# EAGLE schematic schematic (EAGLE 8.2.2)
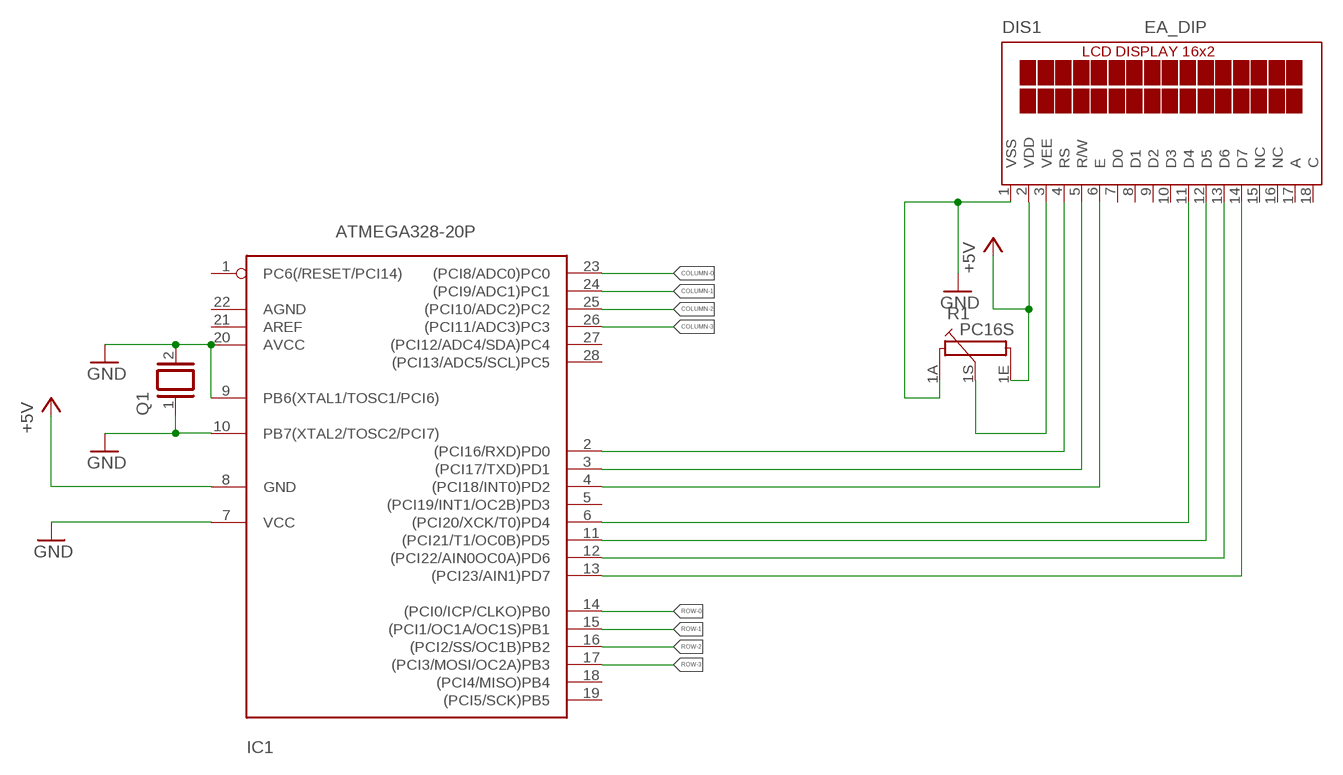
[diagram p0: schematic, sheet 1]

## Parts
DIS1  EA_DIP  [EA_DIP]
IC1  ATMEGA328-20P  [DIL28-3]
Q1  XTAL  [Q]
R1  PC16S  [PC16S]

## Nets
+5V: DIS1.2(VDD) IC1.8(GND) R1.1E
GND: DIS1.1(VSS) IC1.7(VCC) IC1.9(PB6(XTAL1/TOSC1/PCI6)) IC1.10(PB7(XTAL2/TOSC2/PCI7)) IC1.20(AVCC) Q1.1 Q1.2 R1.1A
N$1: DIS1.4(RS) IC1.2((PCI16/RXD)PD0)
N$2: DIS1.5(R/W) IC1.3((PCI17/TXD)PD1)
N$3: DIS1.6(E) IC1.4((PCI18/INT0)PD2)
N$4: DIS1.14(D7) IC1.13((PCI23/AIN1)PD7)
N$5: DIS1.13(D6) IC1.12((PCI22/AIN0OC0A)PD6)
N$6: DIS1.12(D5) IC1.11((PCI21/T1/OC0B)PD5)
N$7: DIS1.11(D4) IC1.6((PCI20/XCK/T0)PD4)
N$9: DIS1.3(VEE) R1.1S
Unconnected: DIS1.7(D0) DIS1.8(D1) DIS1.9(D2) DIS1.10(D3) DIS1.15(NC) DIS1.16(NC) DIS1.17(A) DIS1.18(C) IC1.1(PC6(/RESET/PCI14)) IC1.5((PCI19/INT1/OC2B)PD3) IC1.14((PCI0/ICP/CLKO)PB0) IC1.15((PCI1/OC1A/OC1S)PB1) IC1.16((PCI2/SS/OC1B)PB2) IC1.17((PCI3/MOSI/OC2A)PB3) IC1.18((PCI4/MISO)PB4) IC1.19((PCI5/SCK)PB5) IC1.21(AREF) IC1.22(AGND) IC1.23((PCI8/ADC0)PC0) IC1.24((PCI9/ADC1)PC1) IC1.25((PCI10/ADC2)PC2) IC1.26((PCI11/ADC3)PC3) IC1.27((PCI12/ADC4/SDA)PC4) IC1.28((PCI13/ADC5/SCL)PC5)

## Library data of the parts
DIS1 = display-lcd:EA_DIP: LCD-MODUL 2x16 - 6,68mm, INKL. KONTROLLER HD44780 Source: Data sheet <http://www.lcd-module.de/pdf/doma/dip162-d.pdf>
IC1 = atmega328:ATMEGA328*P: MICROCONTROLLER 32 kBytes FLASH 2 kBytes SRAM 1 kBytes EEPROM USART 8-channel 10 bit ADC
Q1 = special:XTAL: CRYSTAL
R1 = piher:PC16S: POTENTIOMETER single carbon potentiometer, 16 mm, S3ROH; OC_FARNELL: 4452940; OC_NEWARK: unknown